# EAGLE design cc1101-adapter (EAGLE 9.6.2)
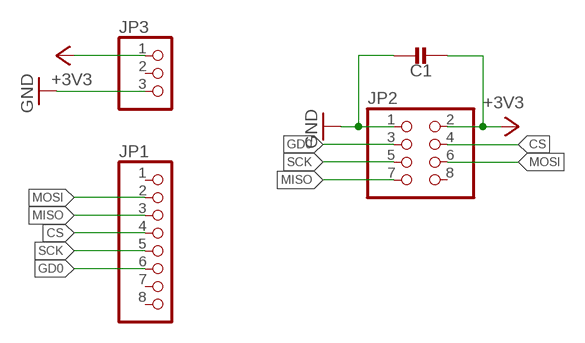
[diagram p0: schematic, sheet 1]

## Parts
C1  CAPACITOR0805_CAP  [0805_CAP]
JP1  PINHD-1X8  [1X08]
JP2  PINHD-2X4  [2X04]
JP3  PINHD-1X3  [1X03]

## Nets
+3V3: C1.P$2 JP2.2 JP3.1
CS: JP1.4 JP2.4
GD0: JP1.6 JP2.3
GND: C1.P$1 JP2.1 JP3.3
MISO: JP1.3 JP2.7
MOSI: JP1.2 JP2.6
SCK: JP1.5 JP2.5
Unconnected: JP1.1 JP1.7 JP1.8 JP2.8 JP3.2

## Library data of the parts
C1 = passives:CAPACITOR: SMD Capacitor
JP1 = pinhead:PINHD-1X8: PIN HEADER
JP2 = pinhead:PINHD-2X4: PIN HEADER
JP3 = pinhead:PINHD-1X3: PIN HEADER

## Board
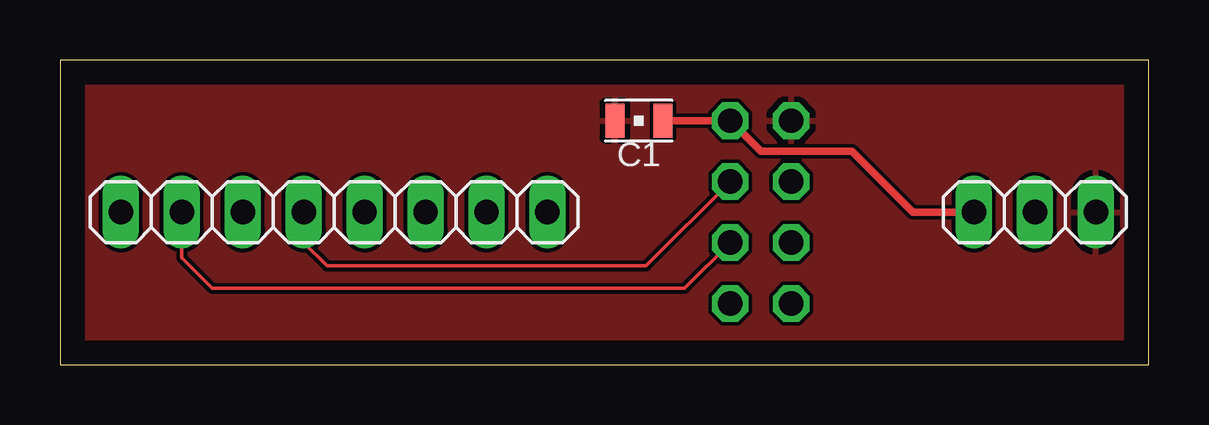
[diagram p1: board, top side]
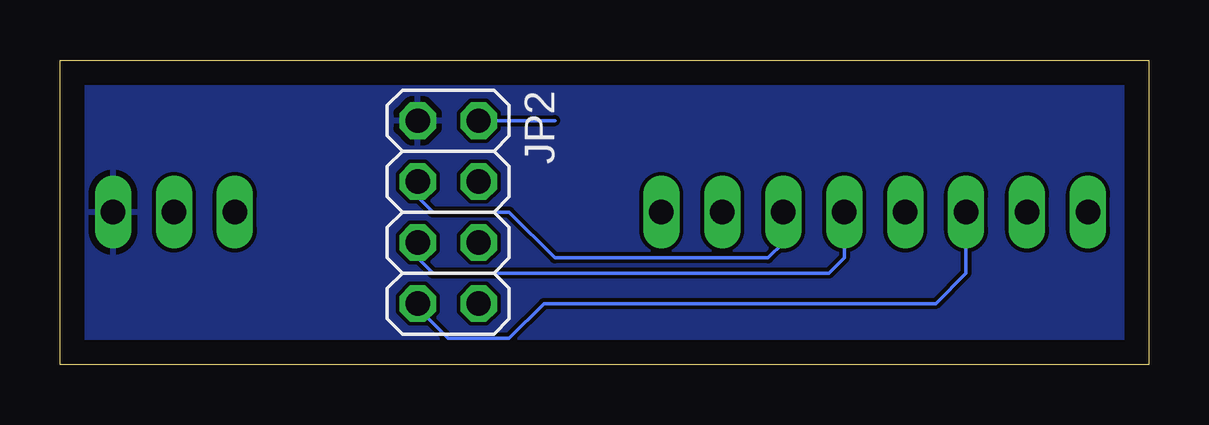
[diagram p2: board, bottom side, seen from below]

Size 45.39 x 12.69 mm. Coordinates in mm from the lower left corner, seen from the top.
Outline: 0,0 45.39,0 45.39,12.69 0,12.69 0,0
Copper layers (1*16): Top 0.035mm / dielectric 1.5mm / Bottom 0.035mm
Design rules "default": minimum track width 6mil, minimum drill 0.35mm, track to track 6mil, track to pad 6mil, pad to pad 6mil, via to via 6mil, smd to smd 6mil, copper to edge 40mil, drill to drill 6mil, minimum pad ring 10mil, minimum via ring 8mil, stop-mask expansion 4mil, vias tented up to drill 0mil, thermal gap 10mil

### Footprints (pad centres in the part's own frame; a part is rotated, then mirrored left to right if it is on the bottom)
0805_CAP = smd 0.8 x 1.4: P$1 1,0; P$2 -1,0
1X08 = drill 1.016 long: 1 -8.89,0; 2 -6.35,0; 3 -3.81,0; 4 -1.27,0; 5 1.27,0; 6 3.81,0; 7 6.35,0; 8 8.89,0
2X04 = drill 1.016 octagon: 1 -3.81,-1.27; 2 -3.81,1.27; 3 -1.27,-1.27; 4 -1.27,1.27; 5 1.27,-1.27; 6 1.27,1.27; 7 3.81,-1.27; 8 3.81,1.27
1X03 = drill 1.016 long: 1 -2.54,0; 2 0,0; 3 2.54,0

### Placement (x,y rotation side)
C1  24.13,10.16 180 top
JP1  11.43,6.35 0 top
JP2  29.21,6.35 270 bottom
JP3  40.64,6.35 0 top

### Tracks (layer width: path | path; a pad name or v marks a point on that pad's centre or on a via)
+3V3
  Top 0.305: JP3.1 35.56,6.35 33.02,8.89 29.21,8.89 JP2.2 C1.P$2
  Bottom 0.152: JP2.2 24.77,10.16
CS
  Top 0.152: JP1.4 10.16,5.08 11.12,4.12 24.43,4.12 JP2.4
GD0
  Bottom 0.152: JP1.6 15.24,5.08 15.88,4.45 24.77,4.45 26.67,6.35 29.84,6.35 30.48,6.99 JP2.3
GND
  pour Top: 0,12.7 45.72,12.7 45.72,0 0,0
  pour Bottom: 0,12.7 45.72,12.7 45.72,0 0,0
MISO
  Bottom 0.152: JP1.3 7.62,3.81 8.89,2.54 25.22,2.54 26.67,1.09 29.21,1.09 30.48,2.36 JP2.7
MOSI
  Top 0.152: JP1.2 5.08,4.45 6.35,3.17 26.04,3.17 JP2.6
SCK
  Bottom 0.152: JP1.5 12.7,4.45 13.34,3.81 29.84,3.81 30.48,4.45 JP2.5